# EAGLE design 5VDC_Supply (EAGLE 7.7.0)
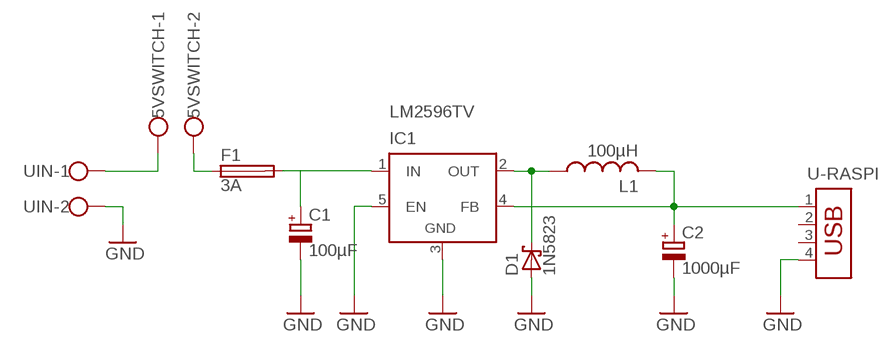
[diagram p0: schematic, sheet 1]

## Parts
5VSWITCH  W237-102  [W237-102]
C1  100µF  CPOL-EUE5-6  [E5-6]
C2  1000µF  CPOL-EUE5-10.5  [E5-10,5]
D1  1N5823  1N5908  [C4111-15]
F1  3A  GSH15  [GSH15]
IC1  LM2596TV  [TO220-51]
L1  100µH  L-USIRF-3  [IRF-3]
U-RASPI  USB-787616  [USB]
UIN  W237-102  [W237-102]

## Nets
GND: C1.- C2.- D1.A IC1.3(GND) IC1.5(EN) U-RASPI.4 UIN.2
N$1: 5VSWITCH.1 UIN.1
N$2: 5VSWITCH.2 F1.1
N$4: C1.+ F1.2 IC1.1(IN)
N$7: D1.C IC1.2(OUT) L1.1
N$8: C2.+ IC1.4(FB) L1.2 U-RASPI.1
Unconnected: U-RASPI.2 U-RASPI.3

## Notes on the sheet
- LM2596TV

## Library data of the parts
5VSWITCH UIN = con-wago-500:W237-102: WAGO SCREW CLAMP; MPN: 237-102; OC_FARNELL: unknown; OC_NEWARK: 70K9898
C1 C2 = rcl:CPOL-EU: POLARIZED CAPACITOR, European symbol
D1 = diode:1N5908: DIODE schottky
F1 = fuse:GSH15: FUSE HOLDER grid 15mm, 19649 Wickmann; MPN: 64900001039; OC_FARNELL: 1271673; OC_NEWARK: 02P0318
IC1 = linear:LM2596T: STEP-DOWN VOLTAGE REGULATOR
L1 = rcl:L-US: INDUCTOR, American symbol
U-RASPI = con-amp:USB-787616: AMP connector

## Board
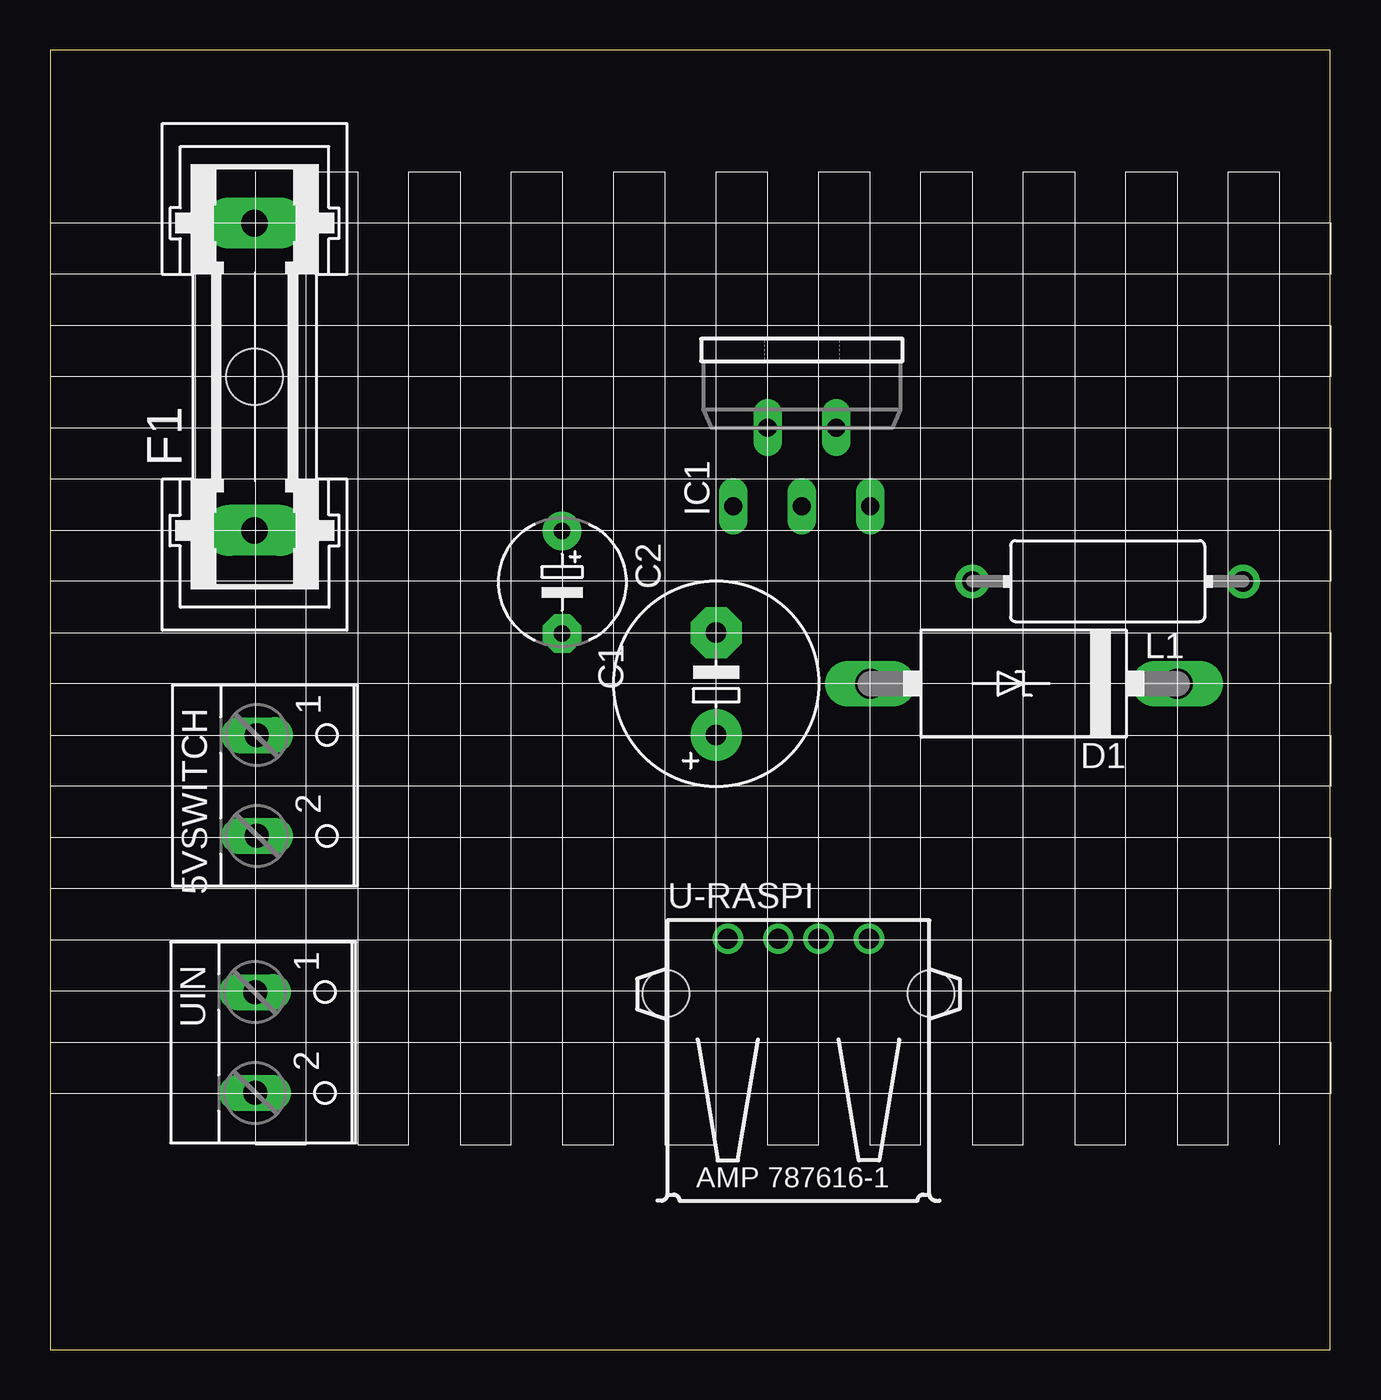
[diagram p1: board, top side]
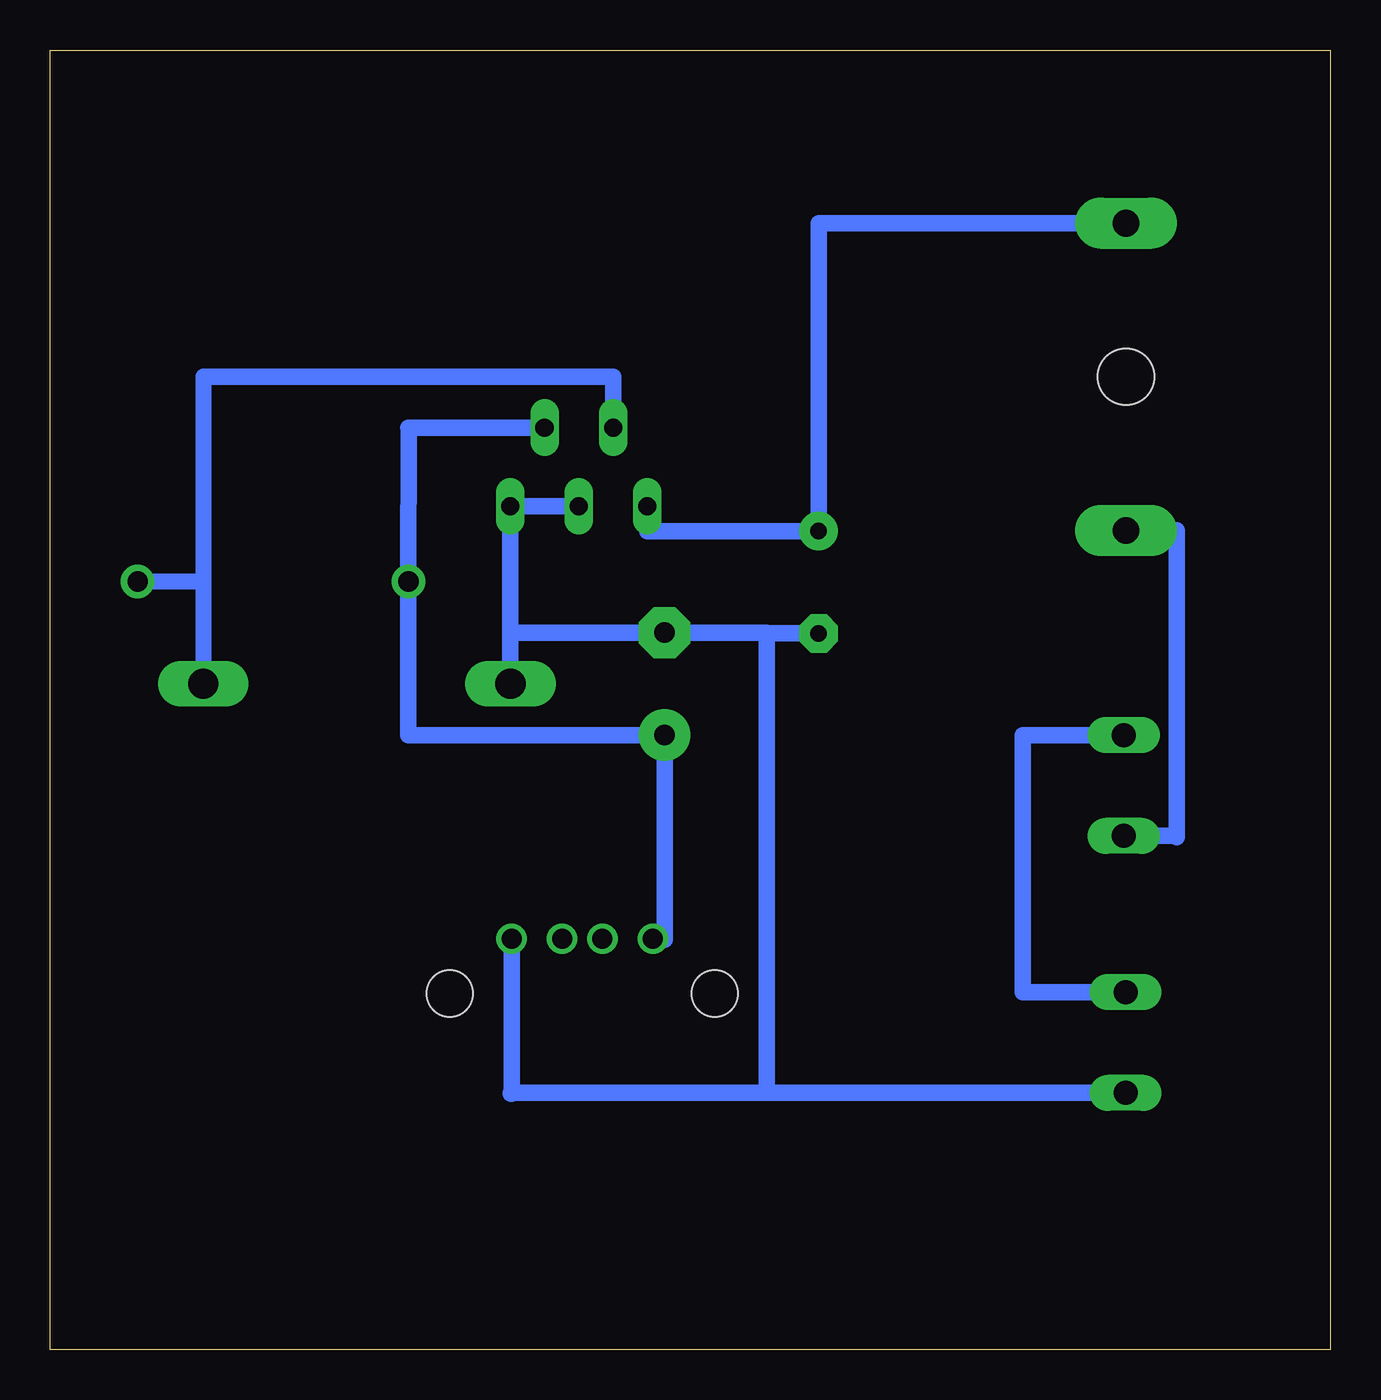
[diagram p2: board, bottom side, seen from below]

Size 63.48 x 64.44 mm. Coordinates in mm from the lower left corner, seen from the top.
Outline: 0,0 63.48,0 63.48,64.44 0,64.44 0,0
Copper layers (1*16): Top 0.035mm / dielectric 1.5mm / Bottom 0.035mm
Design rules "default": minimum track width 10mil, minimum drill 24mil, track to track 8mil, track to pad 8mil, pad to pad 8mil, via to via 8mil, smd to smd 8mil, copper to edge 40mil, drill to drill 8mil, minimum pad ring 10mil, minimum via ring 8mil, stop-mask expansion 4mil, vias tented up to drill 0mil, thermal gap 10mil

### Footprints (pad centres in the part's own frame; a part is rotated, then mirrored left to right if it is on the bottom)
W237-102 = drill 1.194 long: 1 -2.5,-1.27; 2 2.5,-1.27
E5-6 = drill 0.813 pad 1.905: + -2.54,0 | drill 0.813 pad 1.905 octagon: - 2.54,0
E5-10,5 = drill 1.016 pad 2.54: + -2.54,0 | drill 1.016 pad 2.54 octagon: - 2.54,0
C4111-15 = drill 1.499 long: A 7.62,0; C -7.62,0
GSH15 = drill 1.321 pad 2.54 long: 1 -7.62,0; 2 7.62,0 | hole 2.794: 0,0
TO220-51 = drill 0.9 long: 1 -3.4,-8.4; 2 -1.7,-4.5; 3 0,-8.4; 4 1.7,-4.5; 5 3.4,-8.4
IRF-3 = drill 1 pad 1.676: 1 -6.705,0; 2 6.73,0
USB = drill 1: 1 -3.5,12.99; 2 -1,12.99; 3 1,12.99; 4 3.5,12.99 | hole 2.3: -6.57,10.28; 6.57,10.28

### Placement (x,y rotation side)
5VSWITCH  11.51,27.98 270 top
C1  25.38,38.06 270 top
C2  33.02,33.02 90 top
D1  48.28,33.03 180 top
F1  10.13,48.25 90 top
IC1  37.27,50.23 0 top
L1  52.45,38.1 180 top
U-RASPI  37.1,7.39 0 top
UIN  11.42,15.23 270 top

### Tracks (layer width: path | path; a pad name or v marks a point on that pad's centre or on a via)
GND
  Bottom 0.813: 38.1,41.83 IC1.3 IC1.5 40.66,35.56 | 40.66,35.56 C2.- 27.94,35.56 27.94,35.54 27.94,35.52 | 40.66,35.56 D1.A | 27.94,35.52 27.94,12.73 | UIN.2 27.94,12.73 | 27.94,12.73 40.64,12.73 40.64,12.7 40.6,12.7 U-RASPI.4 | C1.- 27.94,35.52
N$1
  Bottom 0.813: UIN.1 15.24,17.73 15.24,30.48 5VSWITCH.1
N$2
  Bottom 0.813: 5VSWITCH.2 7.62,25.48 | 7.62,25.48 7.62,25.4 | 7.62,25.48 7.62,40.64 F1.1
N$4
  Bottom 0.813: F1.2 25.38,55.87 C1.+ 33.87,40.6 IC1.1
N$7
  Bottom 0.8: D1.C 55.88,33.03 55.88,38.1 | 55.88,38.1 55.88,48.26 | L1.1 55.88,38.1
  Bottom 0.813: 55.88,48.26 35.57,48.26 IC1.2
N$8
  Bottom 0.813: IC1.4 45.72,45.73 45.72,45.72 45.71,45.72 L1.2 45.72,30.48 C2.+ | C2.+ 33.6,30.48 | U-RASPI.1 33.02,20.38 | 33.02,20.38 33.02,20.32 | 33.02,20.38 C2.+